# Altium project DXP_Adder.PrjPcb
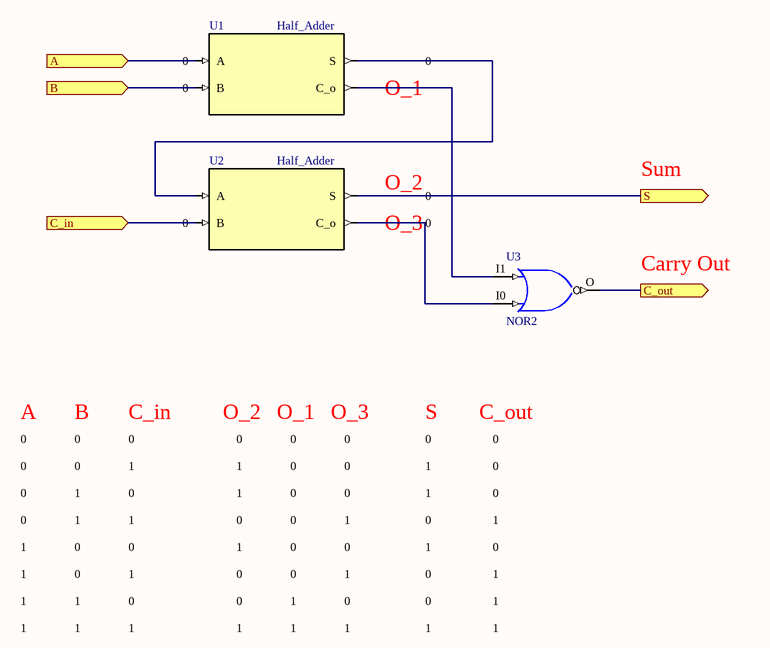
[diagram p0: Full_Adder.SchDoc]
2 sheets, 7 parts. Net scope: flat (ports and power ports of the same name join across sheets).
Sheets:
  Full_Adder.SchDoc
  adder_4bit.SchDoc

## Sheet Full_Adder.SchDoc
size A

### Parts
(Parts that share a designator on the sheet are numbered #1, #2 ... from top to bottom, then left to right.)
U1  Half_Adder
U2  Half_Adder
U3#1  NOR2

### Ports
A (in), B (in), C_in (in), C_out (out), S (out)

### Nets
NetU1_A: U1.A ; port A
NetU1_B: U1.B ; port B
NetU1_C_O: U1.C_O(C_o) U3#1.I1
NetU1_S: U1.S U2.A
NetU2_B: U2.B ; port C_in
NetU2_C_O: U2.C_O(C_o) U3#1.I0
NetU2_S: U2.S ; port S
NetU3#1_O: U3#1.O ; port C_out

### Notes on the sheet
- (near U1) 0
- 0
- (near U1) O_1
- (near U2) O_2
- Sum
- (near U2) 0
- (near U2) O_3
- Carry Out
- A
- B
- C_in
- O_2
- O_1
- O_3
- S
- C_out
- 1

### Library data of the parts
U1 U2 = Half_Adder_BS
U3#1 = NOR2: 2-Input NOR Gate; FPGAVendor: CUPL; Published: 17-Apr-2002; Publisher: Altium Limited

## Sheet adder_4bit.SchDoc
size A4
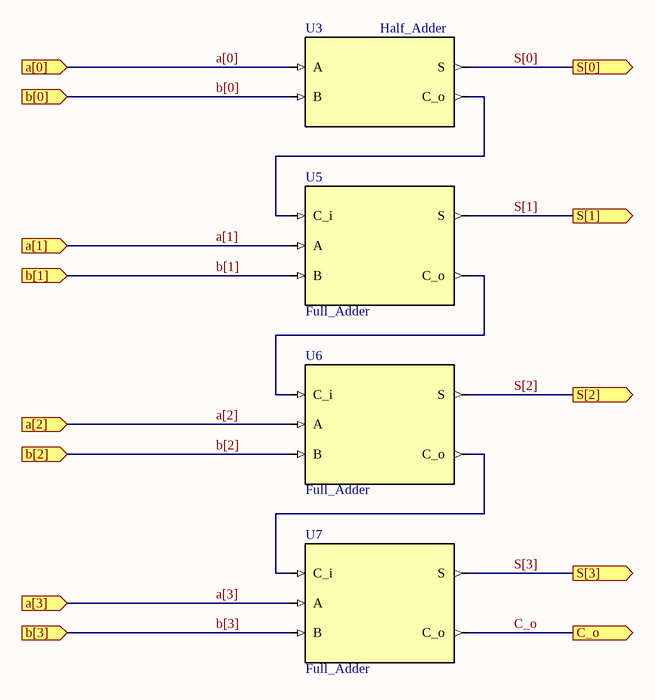
[diagram p1: adder_4bit.SchDoc]

### Parts
(Parts that share a designator on the sheet are numbered #1, #2 ... from top to bottom, then left to right.)
U3#2  Half_Adder
U5  Full_Adder
U6  Full_Adder
U7  Full_Adder

### Ports
a[0] (in), a[1] (in), a[2] (in), a[3] (in), b[0] (in), b[1] (in), b[2] (in), b[3] (in), C_o (out), S[0] (out), S[1] (out), S[2] (out), S[3] (out)

### Nets
a[0]: U3#2.A ; port a[0]
a[1]: U5.A ; port a[1]
a[2]: U6.A ; port a[2]
a[3]: U7.A ; port a[3]
b[0]: U3#2.B ; port b[0]
b[1]: U5.B ; port b[1]
b[2]: U6.B ; port b[2]
b[3]: U7.B ; port b[3]
C_o: U7.C_O(C_o) ; port C_o
S[0]: U3#2.S ; port S[0]
S[1]: U5.S ; port S[1]
S[2]: U6.S ; port S[2]
S[3]: U7.S ; port S[3]
NetU3#2_C_O: U3#2.C_O(C_o) U5.C_i
NetU5_C_O: U5.C_O(C_o) U6.C_i
NetU6_C_O: U6.C_O(C_o) U7.C_i

### Library data of the parts
U3#2 = Half_Adder_BS
U5-U7 = Full_Adder_BS